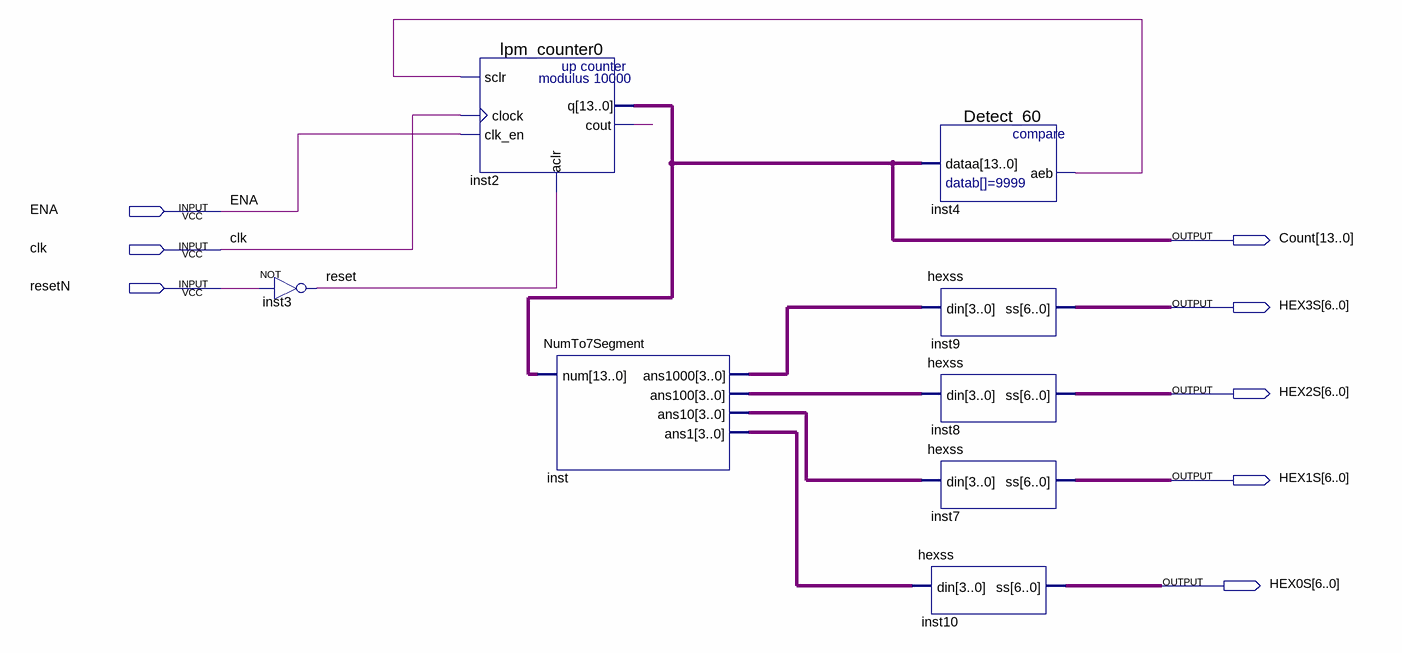
[diagram p0: schematic sheet]
// Quartus schematic BCDUP_60.bdf as structural Verilog: 8 symbols, 8 pins
module BCDUP_60 (
  input  ENA,
  input  clk,
  input  resetN,
  output [13:0] Count,
  output [6:0] HEX3S,
  output [6:0] HEX2S,
  output [6:0] HEX1S,
  output [6:0] HEX0S
);

  wire inst2_cout, inst4_aeb, reset;
  wire [3:0] inst_ans1, inst_ans10, inst_ans100, inst_ans1000;

  not inst3 (reset, resetN);
  lpm_counter0 inst2 (.sclr(inst4_aeb), .clock(clk), .clk_en(ENA), .aclr(reset), .q(Count), .cout(inst2_cout));
  NumTo7Segment inst (.num(Count), .ans1000(inst_ans1000), .ans100(inst_ans100), .ans10(inst_ans10), .ans1(inst_ans1));
  Detect_60 inst4 (.dataa(Count), .aeb(inst4_aeb));
  hexss inst9 (.din(inst_ans1000), .ss(HEX3S));
  hexss inst8 (.din(inst_ans100), .ss(HEX2S));
  hexss inst7 (.din(inst_ans10), .ss(HEX1S));
  hexss inst10 (.din(inst_ans1), .ss(HEX0S));
endmodule
